# EAGLE design quadcopter (EAGLE 9.7.0)
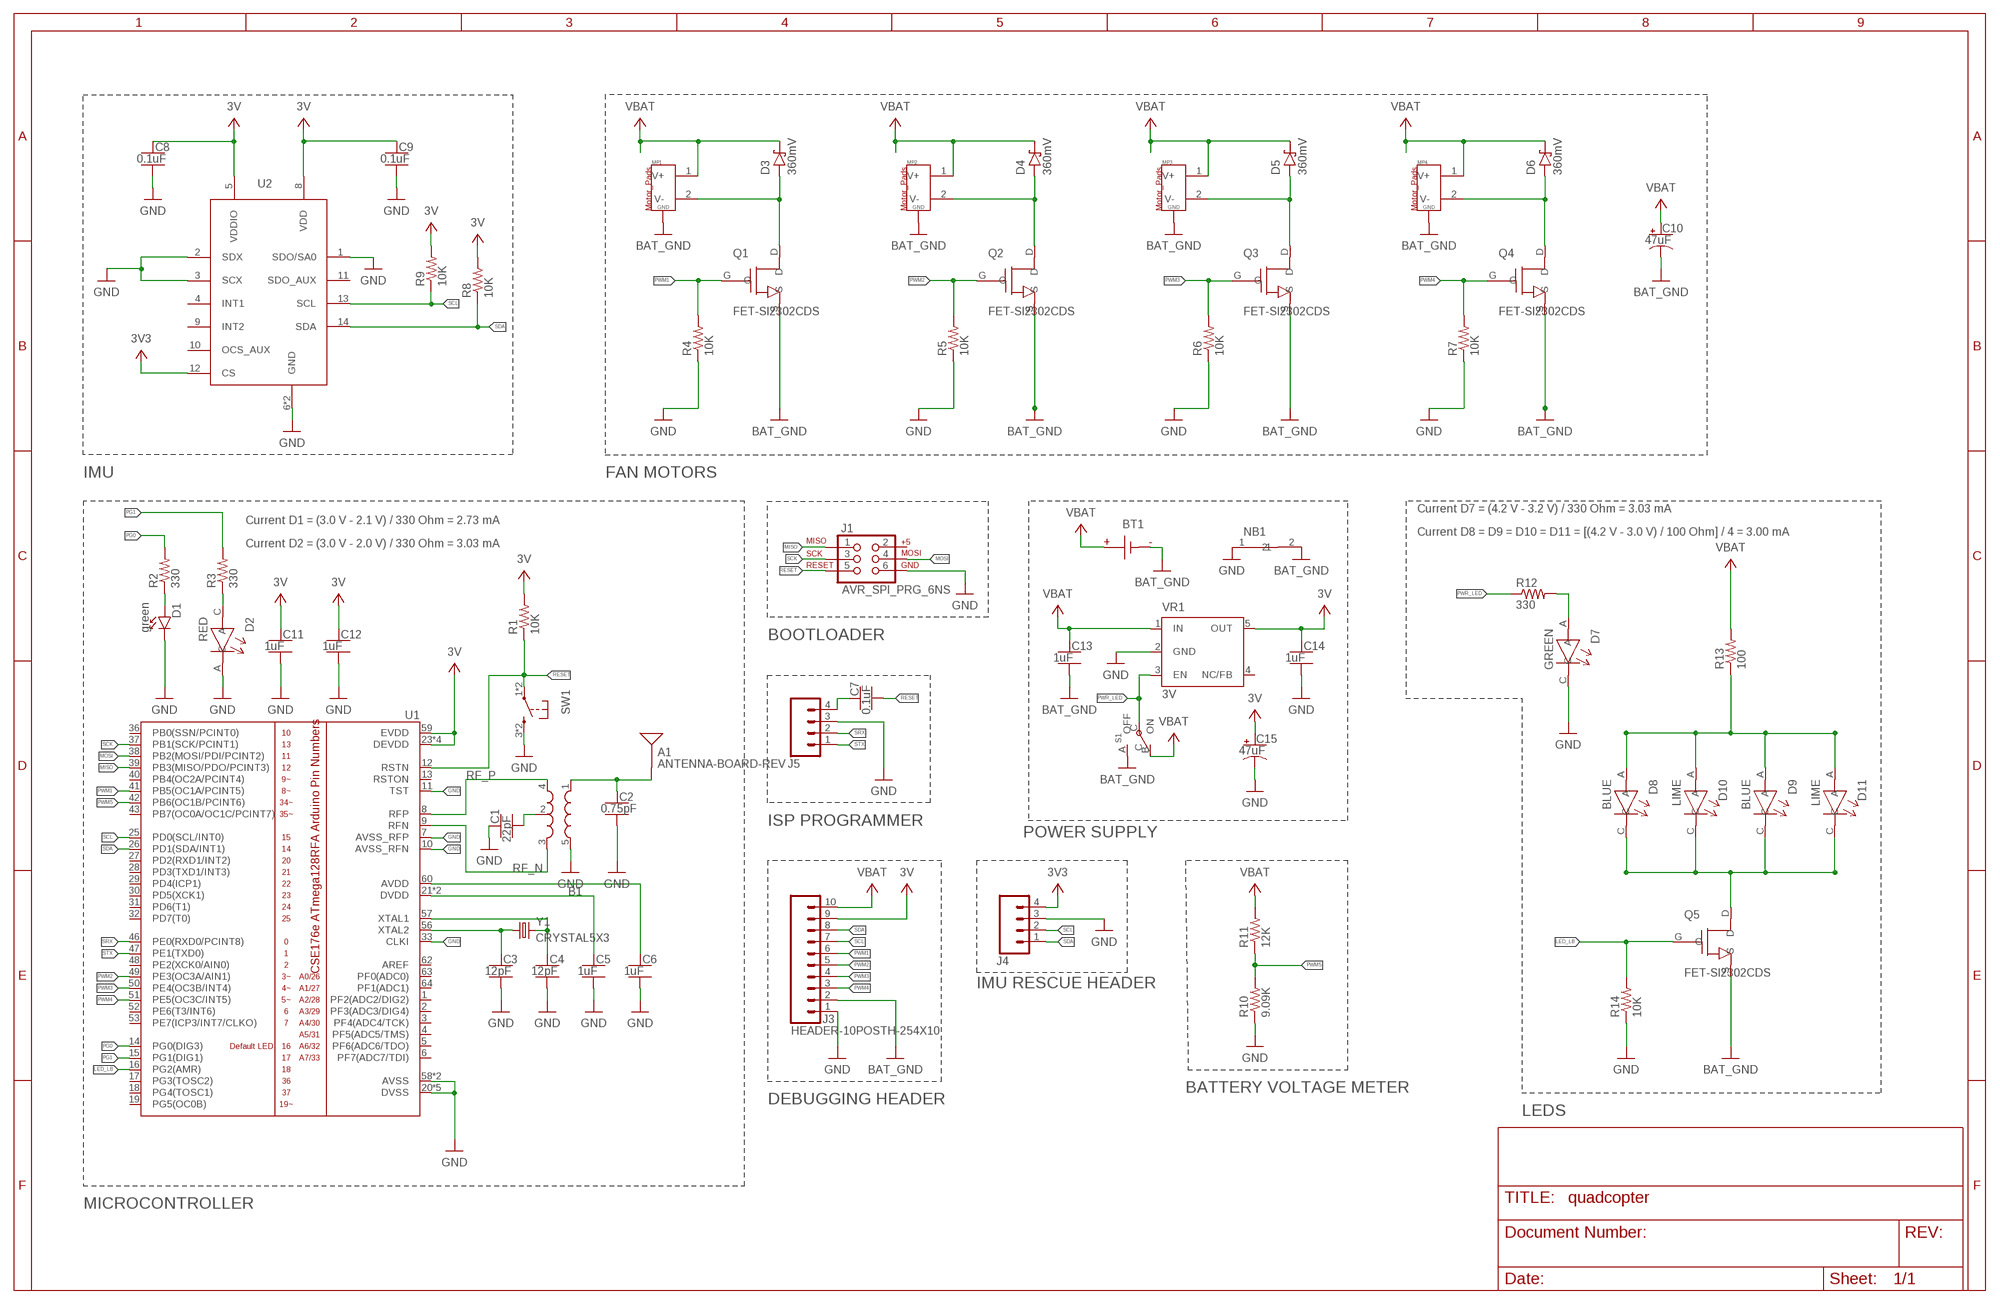
[diagram p0: schematic, sheet 1]
FRAME1 (FRAME_B_L): CREATOR: Unknown; DIST: Unknown; DISTPN: Unknown

## Parts
A1  ANTENNA-BOARD-REV  [ANT_PCB_2.4GHZ_NRF8001_1.6MM_1OZ_REV]
B1  BALUN0805  [BALUN]
BT1  BATTERY-SCREW-TERMINAL  [SCREW-TERMINAL-1X2-2.54MM]
C1  22pF  CAPACITOR-NP_SMD-2012-0805_CERAMIC-22PF  [CAPC2012X140_HS]
C2  0.75pF  CAPACITOR-NP_SMD-2012-0805_CERAMIC-0.75PF  [CAPC2012X140_HS]
C3  12pF  CAPACITOR-NP_SMD-2012-0805_CERAMIC-12PF  [CAPC2012X140_HS]
C4  12pF  CAPACITOR-NP_SMD-2012-0805_CERAMIC-12PF  [CAPC2012X140_HS]
C5  1uF  CAPACITOR-NP_SMD-2012-0805_CERAMIC-1UF  [CAPC2012X140_HS]
C6  1uF  CAPACITOR-NP_SMD-2012-0805_CERAMIC-1UF  [CAPC2012X140_HS]
C7  0.1uF  CAPACITOR-NP_SMD-2012-0805_CERAMIC-0.1UF  [CAPC2012X140_HS]
C8  0.1uF  CAPACITOR-NP_SMD-2012-0805_CERAMIC-0.1UF  [CAPC2012X140_HS]
C9  0.1uF  CAPACITOR-NP_SMD-2012-0805_CERAMIC-0.1UF  [CAPC2012X140_HS]
C10  47uF  CAPACITOR-POL_47UF-SMD-1206-TAJA  [CAPMP3216X180]
C11  1uF  CAPACITOR-NP_SMD-2012-0805_CERAMIC-1UF  [CAPC2012X140_HS]
C12  1uF  CAPACITOR-NP_SMD-2012-0805_CERAMIC-1UF  [CAPC2012X140_HS]
C13  1uF  CAPACITOR-NP_SMD-2012-0805_CERAMIC-1UF  [CAPC2012X140_HS]
C14  1uF  CAPACITOR-NP_SMD-2012-0805_CERAMIC-1UF  [CAPC2012X140_HS]
C15  47uF  CAPACITOR-POL_47UF-SMD-1206-TAJA  [CAPMP3216X180]
D1  green  DIODE-LED_SMD-2012-0805-GREEN  [LEDSC125X200X120-2_HS]
D2  RED  LED-RED  [0805_LED]
D3  360mV  DIODE-SCHOTTKY_-SMD-SOD123  [SODFL3516X96]
D4  360mV  DIODE-SCHOTTKY_-SMD-SOD123  [SODFL3516X96]
D5  360mV  DIODE-SCHOTTKY_-SMD-SOD123  [SODFL3516X96]
D6  360mV  DIODE-SCHOTTKY_-SMD-SOD123  [SODFL3516X96]
D7  GREEN  0805_LED-GREEN  [0805_LED]
D8  BLUE  1411_LED-BLUE  [1411_LED]
D9  BLUE  1411_LED-BLUE  [1411_LED]
D10  LIME  1411_LED-LIME  [1411_LED]
D11  LIME  1411_LED-LIME  [1411_LED]
J1  AVR_SPI_PRG_6NS  [2X3-NS]
J3  HEADER-10POSTH-254X10  [HDRV10W63P254_10X1_2540X254H838_HS]
J4  HEADER-4POS-0.1IN-FEMALE  [HDRVR4W80P254_1X4_1066X254X850B]
J5  HEADER-4POS-0.1IN-FEMALE-SMD-BOTTOM-ENTRY  [HEADER-1X4-BOTTOM-ENTRY]
MP1  MOTOR_PADS_GND-MOLEX-SMD  [MOLEX-0532610271]
MP2  MOTOR_PADS_GND-MOLEX-SMD  [MOLEX-0532610271]
MP3  MOTOR_PADS_GND-MOLEX-SMD  [MOLEX-0532610271]
MP4  MOTOR_PADS_GND-MOLEX-SMD  [MOLEX-0532610271]
NB1  NET-BRIDGE  [NET-BRIDGE]
Q1  FET-SI2302CDS  [SI2302MOSFET]
Q2  FET-SI2302CDS  [SI2302MOSFET]
Q3  FET-SI2302CDS  [SI2302MOSFET]
Q4  FET-SI2302CDS  [SI2302MOSFET]
Q5  FET-SI2302CDS  [SI2302MOSFET]
R1  10K  RESISTOR_SMD-2012-0805-10K  [RESC2012X60_HS]
R2  330  RESISTOR_SMD-2012-0805-330  [RESC2012X60_HS]
R3  330  RESISTOR_SMD-2012-0805-330  [RESC2012X60_HS]
R4  10K  RESISTOR_SMD-2012-0805-10K  [RESC2012X60_HS]
R5  10K  RESISTOR_SMD-2012-0805-10K  [RESC2012X60_HS]
R6  10K  RESISTOR_SMD-2012-0805-10K  [RESC2012X60_HS]
R7  10K  RESISTOR_SMD-2012-0805-10K  [RESC2012X60_HS]
R8  10K  RESISTOR_SMD-2012-0805-10K  [RESC2012X60_HS]
R9  10K  RESISTOR_SMD-2012-0805-10K  [RESC2012X60_HS]
R10  9.09K  RESISTOR_SMD-2012-0805-9.09K  [RESC2012X60_HS]
R11  12K  RESISTOR_SMD-2012-0805-12K  [RESC2012X60_HS]
R12  330  RESISTOR_SMD-2012-0805-330  [RESC2012X60_HS]
R13  100  RESISTOR_SMD-2012-0805-100  [RESC2012X60_HS]
R14  10K  RESISTOR_SMD-2012-0805-10K  [RESC2012X60_HS]
S1  POWER-SWITCH-MFS201N-9-Z-SMD-EDGE  [JS102011SAQN]
SW1  PUSHBUTTON_SMD-VERTICAL-1  [TE_FSM8JSMA_HS]
U1  ATMEGA128RFA1  [QFN-64]
U2  IMU_LSM6DSOX-LSM6DSOXTR  [LSM6DS0XTR]
VR1  3V  TPS73633-DBVT3V  [SOT23-DBV]
Y1  CRYSTAL5X3  [CRYSTAL-SMD-5X3]

## Nets
3V3 [PWR]: C8.1 C9.1 C11.1 C12.1 C14.1 C15.1(+) J3.9 J4.4 R1.2 R8.2 R9.2 U1.23(DEVDD) U1.34(DEVDD) U1.44(DEVDD) U1.54(DEVDD) U1.59(EVDD) U2.5(VDDIO) U2.8(VDD) U2.12(CS) VR1.5(OUT) ; supply symbol labelled 3V
BAT_GND [HIGHCURRENT]: BT1.1(N) C10.2(-) C13.2 J3.2 MP1.G1(GND) MP1.G2(GND) MP2.G1(GND) MP2.G2(GND) MP3.G1(GND) MP3.G2(GND) MP4.G1(GND) MP4.G2(GND) NB1.2 Q1.S Q2.S Q3.S Q4.S Q5.S S1.A(OFF)
GND [PWR]: B1.5(GND) C1.1 C2.2 C3.2 C4.2 C5.2 C6.2 C8.2 C9.2 C11.2 C12.2 C14.2 C15.2(-) D1.C D2.A(C) D7.C J1.6 J3.1 J4.3 J5.3 NB1.1 R4.1 R5.1 R6.1 R7.1 R10.1 R14.1 SW1.3 SW1.4 U1.7(AVSS_RFP) U1.10(AVSS_RFN) U1.11(TST) U1.20(DVSS) U1.24(DVSS) U1.33(CLKI) U1.35(DVSS) U1.45(DVSS) U1.55(DVSS) U1.58(AVSS) U1.61(AVSS) U2.1(SDO/SA0) U2.2(SDX) U2.3(SCX) U2.6(GND) U2.7(GND) VR1.2(GND)
LED_LB: Q5.G R14.2 U1.16(PG2(AMR))
MISO: J1.1 U1.39(PB3(MISO/PDO/PCINT3))
MOSI: J1.4 U1.38(PB2(MOSI/PDI/PCINT2))
N$1: B1.2(GND) C1.2
N$4 [RFSIG]: A1.FEED(SIGNAL) B1.1(IN) C2.1
N$6 [HIGHCURRENT]: D3.2(A) MP1.2(V-) Q1.D
N$8: D1.A R2.1
N$9: C3.1 U1.56(XTAL2) Y1.1
N$10: C4.1 U1.57(XTAL1) Y1.3
N$11: C5.1 U1.21(DVDD) U1.22(DVDD)
N$12: C6.1 U1.60(AVDD)
N$13 [HIGHCURRENT]: D4.2(A) MP2.2(V-) Q2.D
N$14 [HIGHCURRENT]: D5.2(A) MP3.2(V-) Q3.D
N$15 [HIGHCURRENT]: D6.2(A) MP4.2(V-) Q4.D
N$16: C7.1 J5.4
N$17: D2.C(A) R3.1
N$20: D7.A R12.2
N$21: D8.A D9.A D10.A D11.A R13.1
N$22: D8.C D9.C D10.C D11.C Q5.D
PG0: R2.2 U1.14(PG0(DIG3))
PG1: R3.2 U1.15(PG1(DIG1))
PWM1: J3.6 Q1.G R4.2 U1.41(PB5(OC1A/PCINT5))
PWM2: J3.5 Q2.G R5.2 U1.49(PE3(OC3A/AIN1))
PWM3: J3.4 Q3.G R6.2 U1.50(PE4(OC3B/INT4))
PWM4: J3.3 Q4.G R7.2 U1.51(PE5(OC3C/INT5))
PWM5: R10.2 R11.1 U1.42(PB6(OC1B/PCINT6))
PWR_LED: R12.1 S1.C VR1.3(EN)
RESET: C7.2 J1.5 R1.1 SW1.1 SW1.2 U1.12(RSTN)
RF_N: B1.3(OUT2) U1.9(RFN)
RF_P: B1.4(OUT1) U1.8(RFP)
SCK: J1.3 U1.37(PB1(SCK/PCINT1))
SCL: J3.7 J4.2 R9.1 U1.25(PD0(SCL/INT0)) U2.13(SCL)
SDA: J3.8 J4.1 R8.1 U1.26(PD1(SDA/INT1)) U2.14(SDA)
SRX: J5.2 U1.46(PE0(RXD0/PCINT8))
STX: J5.1 U1.47(PE1(TXD0))
VBAT [HIGHCURRENT]: BT1.2(P) C10.1(+) C13.1 D3.1(C) D4.1(C) D5.1(C) D6.1(C) J3.10 MP1.1(V+) MP2.1(V+) MP3.1(V+) MP4.1(V+) R11.2 R13.2 S1.B(ON) VR1.1(IN)
Unconnected: J1.2 U1.1(PF2(ADC2/DIG2)) U1.2(PF3(ADC3/DIG4)) U1.3(PF4(ADC4/TCK)) U1.4(PF5(ADC5/TMS)) U1.5(PF6(ADC6/TDO)) U1.6(PF7(ADC7/TDI)) U1.13(RSTON) U1.17(PG3(TOSC2)) U1.18(PG4(TOSC1)) U1.19(PG5(OC0B)) U1.27(PD2(RXD1/INT2)) U1.28(PD3(TXD1/INT3)) U1.29(PD4(ICP1)) U1.30(PD5(XCK1)) U1.31(PD6(T1)) U1.32(PD7(T0)) U1.36(PB0(SSN/PCINT0)) U1.40(PB4(OC2A/PCINT4)) U1.43(PB7(OC0A/OC1C/PCINT7)) U1.48(PE2(XCK0/AIN0)) U1.52(PE6(T3/INT6)) U1.53(PE7(ICP3/INT7/CLKO)) U1.62(AREF) U1.63(PF0(ADC0)) U1.64(PF1(ADC1)) U2.4(INT1) U2.9(INT2) U2.10(OCS_AUX) U2.11(SDO_AUX) VR1.4(NC/FB)

## Notes on the sheet
- IMU | FAN MOTORS
- Current D7 = (4.2 V - 3.2 V) / 330 Ohm = 3.03 mA
- Current D1 = (3.0 V - 2.1 V) / 330 Ohm = 2.73 mA
- Current D8 = D9 = D10 = D11 = [(4.2 V - 3.0 V) / 100 Ohm] / 4 = 3.00 mA
- Current D2 = (3.0 V - 2.0 V) / 330 Ohm = 3.03 mA
- BOOTLOADER
- ISP PROGRAMMER
- POWER SUPPLY
- IMU RESCUE HEADER
- BATTERY VOLTAGE METER
- DEBUGGING HEADER
- LEDS
- MICROCONTROLLER

## Library data of the parts
A1 = quadparts_prebuilt_2022:ANTENNA: Single endded antenna.; CREATOR: Swanson; DESC: trace antenna; DIST: NA; DISTPN: NA; MFR: NA; MOUNTING: NONE; MPN: NA; POPULATE: NO
B1 = quadparts_prebuilt_2022:BALUN: A balun to convert differential radio-frequency outputs from the microcontroller into a single-ended driver for the antenna.; CREATOR: Swanson; DATASHEET: http://katalog.we-online.de/pbs/datasheet/748421245.pdf; DESC: BALUN 2.4GHZ-2.5GHZ 50/100 0805; DIST: Digikey; DISTPN: 732-2230-1-ND; MFR: Wurth Electronics Inc.; MOUNTING: SMD; MPN: 748421245; PACKAGE: 0805; PRICE: 2.63; REVIEWER: Swanson
BT1 = quadparts_prebuilt:BATTERY: Connections for a battery.; CREATOR: Swanson; DIST: DIGIKEY; DISTPN: ED10561-ND; MOUNTING: TH; PIN1: -; PIN2: +
C1 = quadparts_prebuilt:CAPACITOR-NP_: Nonpolarized capacitor; CREATOR: Swanson; DESC: CAP CER 22PF 250V C0G/NP0 0805; DIST: Digikey; DISTPN: 490-5534-1-ND; MFR: Murata Electronics; MOUNTING: SMD; MPN: GRM21A5C2E220JW01D; PACKAGE: 0805; REVIEWER: Swanson
C2 = quadparts_prebuilt:CAPACITOR-NP_: Nonpolarized capacitor; CREATOR: Swanson; DESC: CAP CER 0.75PF 100V C0G/NP0 0805; DIST: Digikey; DISTPN: 490-3585-1-ND; MFR: Murata Electronics; MOUNTING: SMD; MPN: GQM2195C2AR75CB01D; PACKAGE: 0805; REVIEWER: Swanson
C3 C4 = quadparts_prebuilt:CAPACITOR-NP_: Nonpolarized capacitor; CREATOR: Swanson; DESC: CAP CER 12PF 250V C0G/NP0 0805; DIST: Digikey; DISTPN: 490-5531-1-ND; MFR: Murata Electronics; MOUNTING: SMD; MPN: GRM21A5C2E120JW01D; PACKAGE: 0805; REVIEWER: Swanson
C5 C6 C11-C14 = quadparts_prebuilt:CAPACITOR-NP_: Nonpolarized capacitor; CREATOR: Swanson; DIST: Digikey; DISTPN: 587-1281-1-ND; MFR: Taiyo Yuden; MOUNTING: SMD; MPN: TMK212B7105KG-T; REVIEWER: Swanson
C7-C9 = quadparts_prebuilt:CAPACITOR-NP_: Nonpolarized capacitor; CREATOR: Swanson; DESC: CAP CER 0.1UF 100V X7R 0805; DIST: Digikey; DISTPN: 445-1418-1-ND; MFR: TDK Corporation; MOUNTING: SMD; MPN: C2012X7R2A104K125AA; PACKAGE: 0805; REVIEWER: Swanson
C10 C15 = quadparts_prebuilt:CAPACITOR-POL_: Polarized capacitor; CREATOR: Swanson; DESC: CAP TANT 47UF 10% 6.3V 1206; DIST: DIGIKEY; DISTPN: 478-11462-1-ND; MFR: AVX Corporation; MOUNTING: SMD; MPN: TAJA476K006SNJV; PACKAGE: 1206
D1 = quadparts_prebuilt:DIODE-LED_: Light emitting diode; CREATOR: Swanson; DIST: Digikey; DISTPN: 160-1179-1-ND; MFR: Lite-On Inc; MOUNTING: SMD; MPN: LTST-C170GKT; REVIEWER: Swanson
D2 = custom:LED; CREATOR: CHRISTOPHER VU; DIST: Digikey; DISTPN: 160-1178-1-ND
D3-D6 = quadparts_prebuilt:DIODE-SCHOTTKY_: Schottky diode; CREATOR: Swanson; DESC: DIODE SCHOTTKY 30V 1.5A SFLAT; DIST: Digikey; DISTPN: CRS08QMCT-ND; MFR: Toshiba Semiconductor and Storage; MOUNTING: SMD; MPN: CRS08(TE85L,Q,M); REVIEWER: Swanson
D7 = LED:0805_LED; CREATOR: CHRISTOPHER VU; DIST: Digikey; DISTPN: 732-4983-1-ND
D8 D9 = LED:1411_LED; CREATOR: CHRISTOPHER VU; DIST: Digikey; DISTPN: 1416-2058-1-ND
D10 D11 = LED:1411_LED; CREATOR: CHRISTOPHER VU; DIST: Digikey; DISTPN: 1416-2057-1-ND
J1 = quadparts_prebuilt_2022:AVR_SPI_PRG_6: AVR ISP 6 Pin This is the in-system programming (ISP) connector for Atmel Microcontrollers programming.; CREATOR: Swanson; DATASHEET: http://portal.fciconnect.com/Comergent//fci/drawing/67996.pdf; DIST: Digikey; DISTPN: 609-3234-ND; MFR: Amphenol FCI; MOUNTING: TH; MPN: 67997-206HLF; PRICE: 0.31; REVIEWER: Swanson
J3 = quadparts_prebuilt:HEADER-10POS: 10 pin single inline pin header, socket, or connector; CREATOR: Swanson; DATASHEET: http://portal.fciconnect.com/Comergent//fci/drawing/68000.pdf; DIST: Digikey; DISTPN: 609-3250-ND; MFR: Amphenol FCI; MOUNTING: TH; MPN: 68000-110HLF; PRICE: 0.55; REVIEWER: Swanson
J4 = quadparts_prebuilt:HEADER-4POS; CREATOR: Swanson; DIST: Digikey; DISTPN: S7002-ND
J5 = quadparts_prebuilt:HEADER-4POS; CREATOR: Swanson; DESC: CONN RCPT 4POS 0.1 GOLD SMD; DIST: DIGIKEY; DISTPN: A121787CT-ND; MFR: TE Connectivity AMP Connectors; MOUNTING: SMD; MPN: 1241152-4
MP1-MP4 = quadparts_prebuilt:MOTOR_PADS_GND: Connections a brushed motor.; CREATOR: Swanson; DESC: CONN HEADER SMD R/A 2POS 1.25MM; DIST: DIGIKEY; DISTPN: WM7620CT-ND; MFR: Molex; MOUNTING: SMD; MPN: 532610271
NB1 = custom_:NET-BRIDGE; CREATOR: DARRYL TAYAG; DIST: N/A; DISTPN: N/A
Q1-Q5 = custom:FET; CREATOR: CHRISTOPHER VU; DIST: Digikey; DISTPN: SI2302CDS-T1-E3CT-ND
R1 R4-R9 R14 = quadparts_prebuilt:RESISTOR_: Resistor; CREATOR: Swanson; DESC: RES SMD 10K OHM 5% 1/8W 0805; DIST: Digikey; DISTPN: 311-10KARCT-ND; MFR: Yageo; MOUNTING: SMD; MPN: RC0805JR-0710KL; PACKAGE: 0805; REVIEWER: Swanson
R2 R3 R12 = quadparts_prebuilt:RESISTOR_: Resistor; CREATOR: Swanson; DIST: Digikey; DISTPN: 311-330ARCT-ND; MFR: Yageo; MOUNTING: SMD; MPN: RC0805JR-07330RL; REVIEWER: Swanson
R10 = quadparts_prebuilt:RESISTOR_: Resistor; CREATOR: Swanson; DIST: DIGIKEY; DISTPN: YAG5383CT-ND; MOUNTING: SMD
R11 = quadparts_prebuilt:RESISTOR_: Resistor; CREATOR: Swanson; DIST: DIGIKEY; DISTPN: YAG3692CT-ND; MOUNTING: SMD
R13 = quadparts_prebuilt:RESISTOR_: Resistor; CREATOR: Swanson; DIST: Digikey; DISTPN: 311-100ARCT-ND; MFR: Yageo; MOUNTING: SMD; MPN: RC0805JR-07100RL; REVIEWER: Swanson
S1 = quadparts_prebuilt:POWER-SWITCH-MFS201N-9-Z; CREATOR: Swanson; DESC: SWITCH SLIDE SPDT 300MA 6V; DIST: DIGIKEY; DISTPN: 401-1999-1-ND; MFR: C&K; MOUNTING: SMD; MPN: JS102011SAQN
SW1 = quadparts_prebuilt_2022:PUSHBUTTON_: "Tactile" or "clicky" button.; CREATOR: Swanson; DIST: Digikey; DISTPN: 450-1129-ND; MFR: TE Connectivity Alcoswitch Switches; MOUNTING: SMD; MPN: FSM4JSMA; REVIEWER: Swanson
U1 = quadparts_prebuilt_2022:ATMEGA128RFA1: ATmega128RFA1 8-bit AVR Microcontroller with Low Power 2.4GHz Transceiver for ZigBee and IEEE 802.15.4; CREATOR: Swanson; DATASHEET: http://www.atmel.com/Images/Atmel-8266-MCU_Wireless-ATmega128RFA1_Datasheet.pdf; DESC: IC RF TXRX+MCU 802.15.4 64VFQFN; DIST: Digikey; DISTPN: ATMEGA128RFA1-ZU-ND; MFR: Microchip Technology; MOUNTING: SMD; MPN: ATMEGA128RFA1-ZU; PACKAGE: QFN; PRICE: 10.21; REVIEWER: Swanson
U2 = custom:IMU_LSM6DSOX; CREATOR: CHRISTOPHER VU; DIST: Digikey; DISTPN: 497-18367-1-ND
VR1 = quadparts_prebuilt:TPS73633-DBVT: LP3985-series voltage regulators.; CREATOR: Swanson; DATASHEET: http://www.ti.com/lit/ds/symlink/lp3985.pdf; DIST: Digikey; DISTPN: LP3985IM5X-3.0/NOPBCT-ND; MFR: Texas Instruments; MOUNTING: SMD; MPN: LP3985IM5X-3.0/NOPB; PRICE: 0.59; REVIEWER: Swanson
Y1 = quadparts_prebuilt_2022:CRYSTAL: Crystals to provide clock references for microcontrollers, etc.; CREATOR: Swanson; DATASHEET: http://www.abracon.com/Resonators/abm3b.pdf; DESC: CRYSTAL 16.0000MHZ 18PF SMD; DIST: Digikey; DISTPN: 535-9122-1-ND; MFR: Abracon LLC; MOUNTING: SMD; MPN: ABM3B-16.000MHZ-B2-T; PRICE: 0.68; PROD_ID: XTAL-08218; REVIEWER: Swanson

## Net classes
1 RFSIG: width 1.27 mm
2 PWR: width 0.254 mm, drill 0.35 mm
3 HIGHCURRENT: width 0.762 mm, drill 0.508 mm

## Board
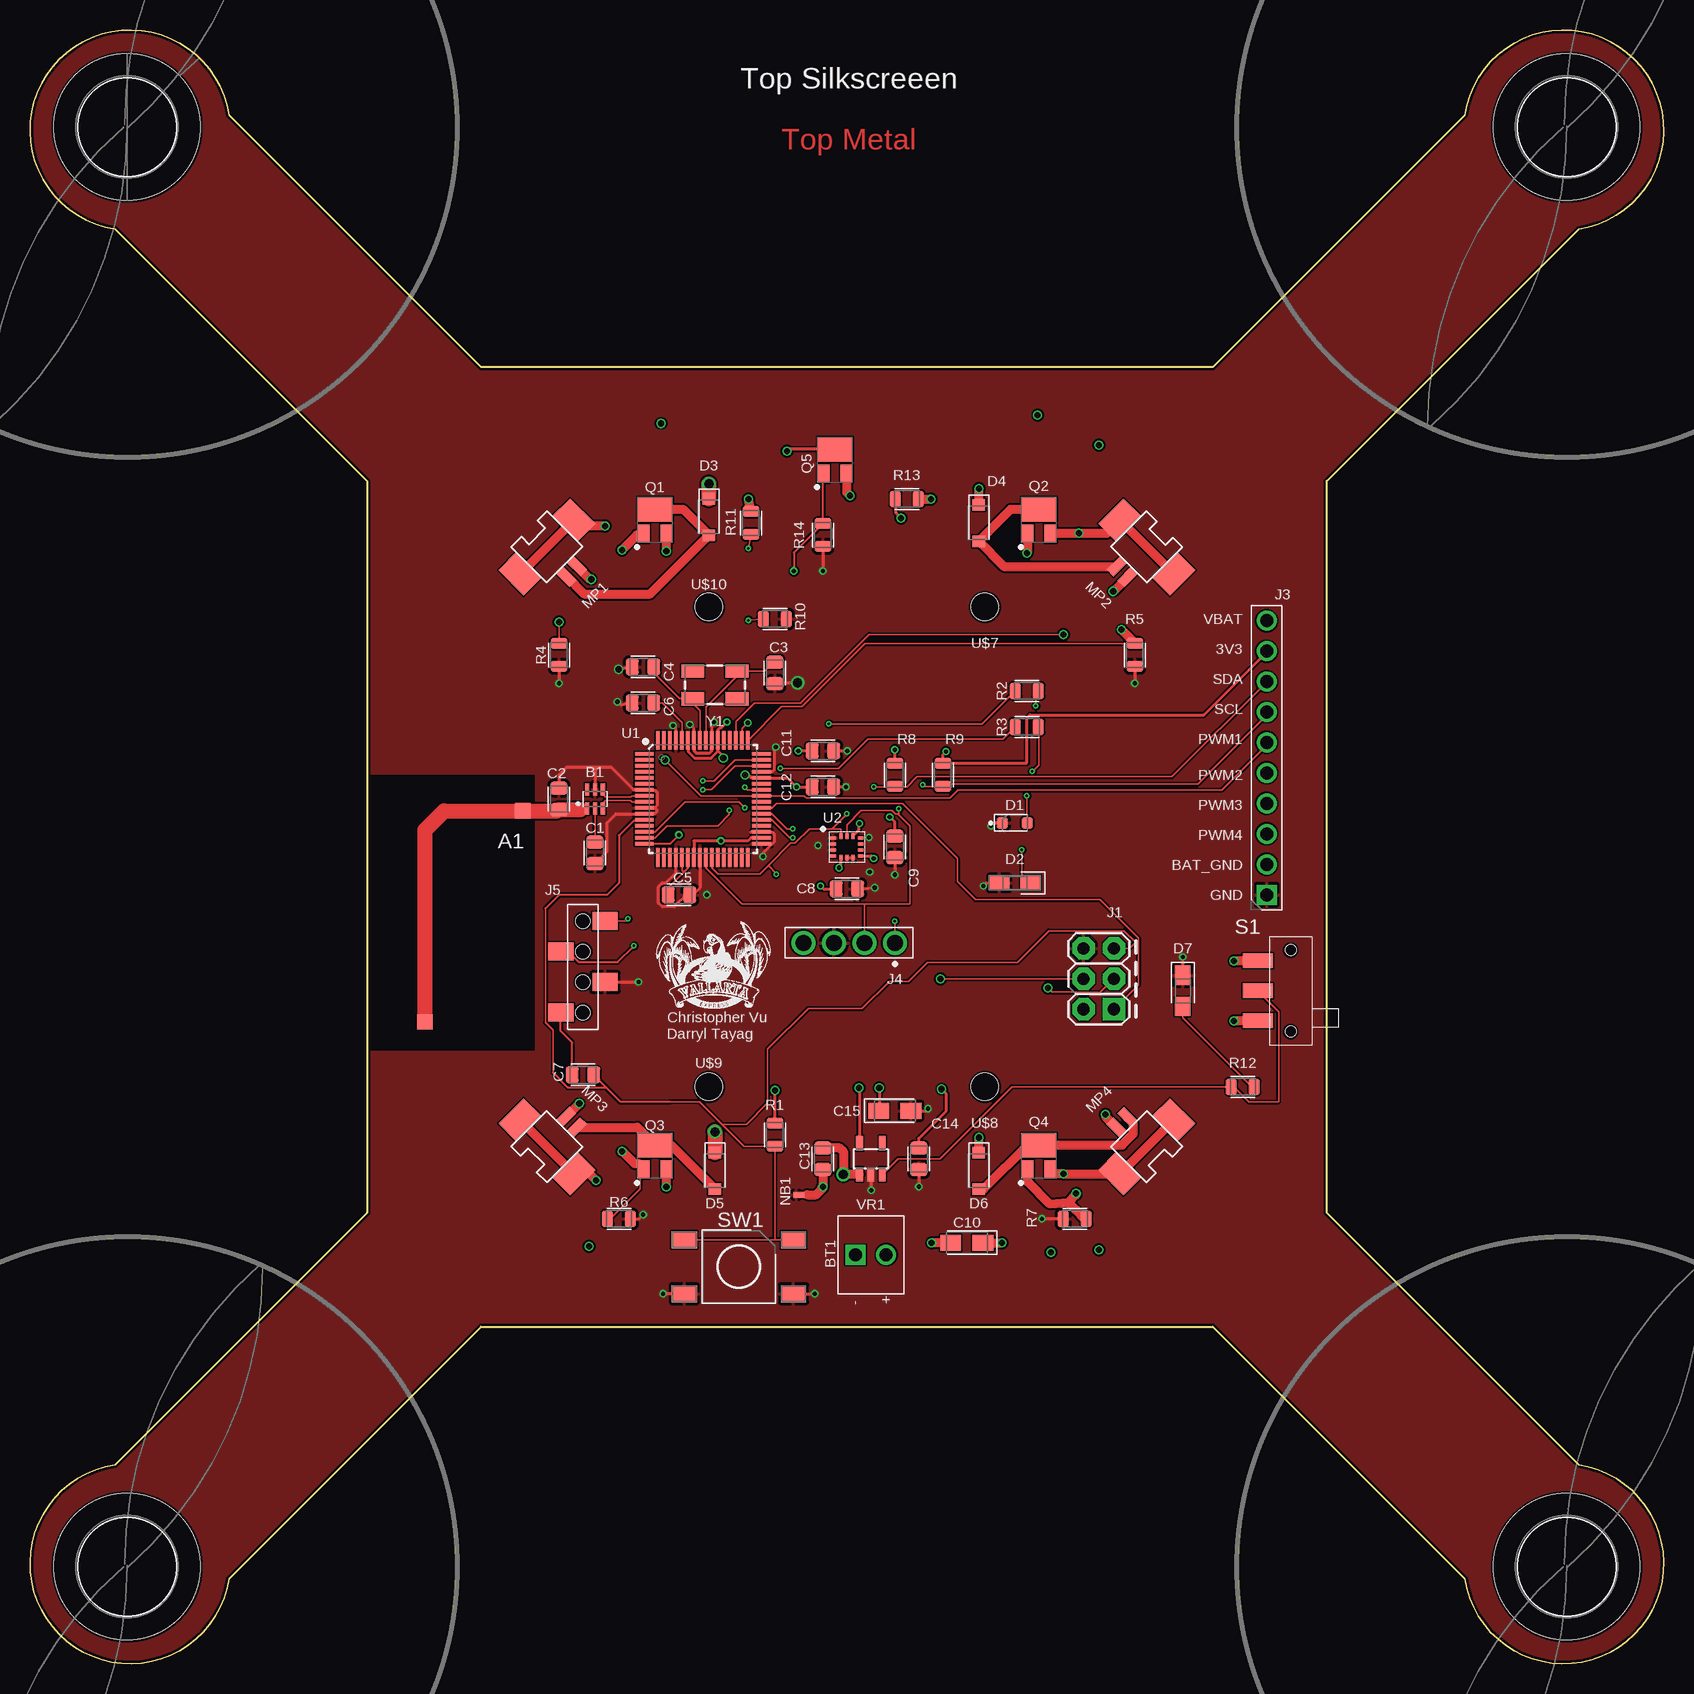
[diagram p1: board, top side]
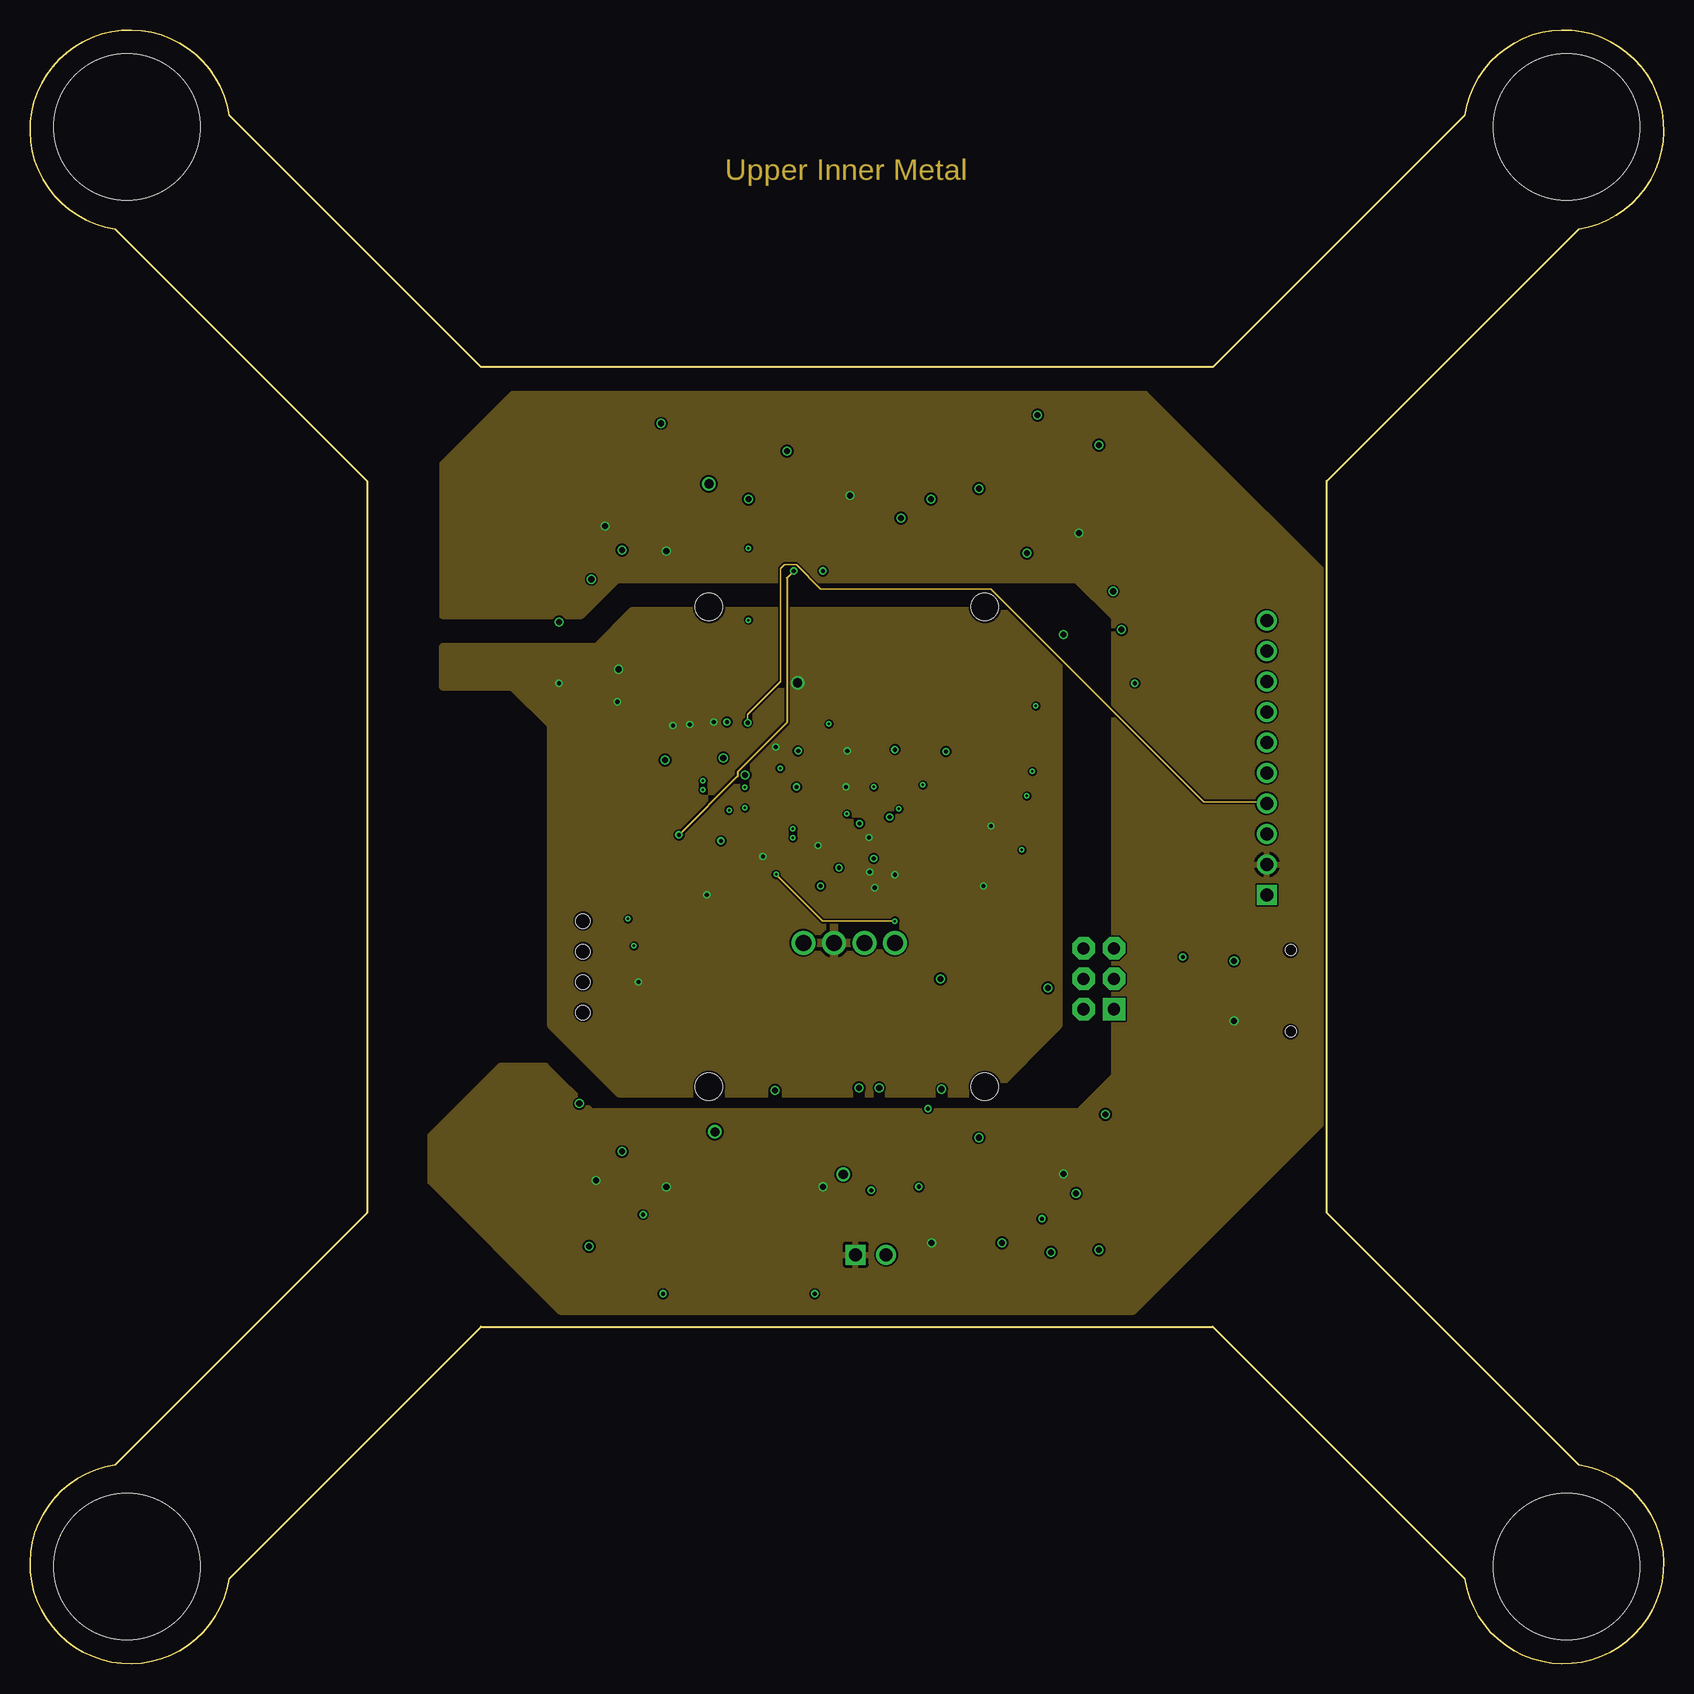
[diagram p2: board, inner layer Route2]
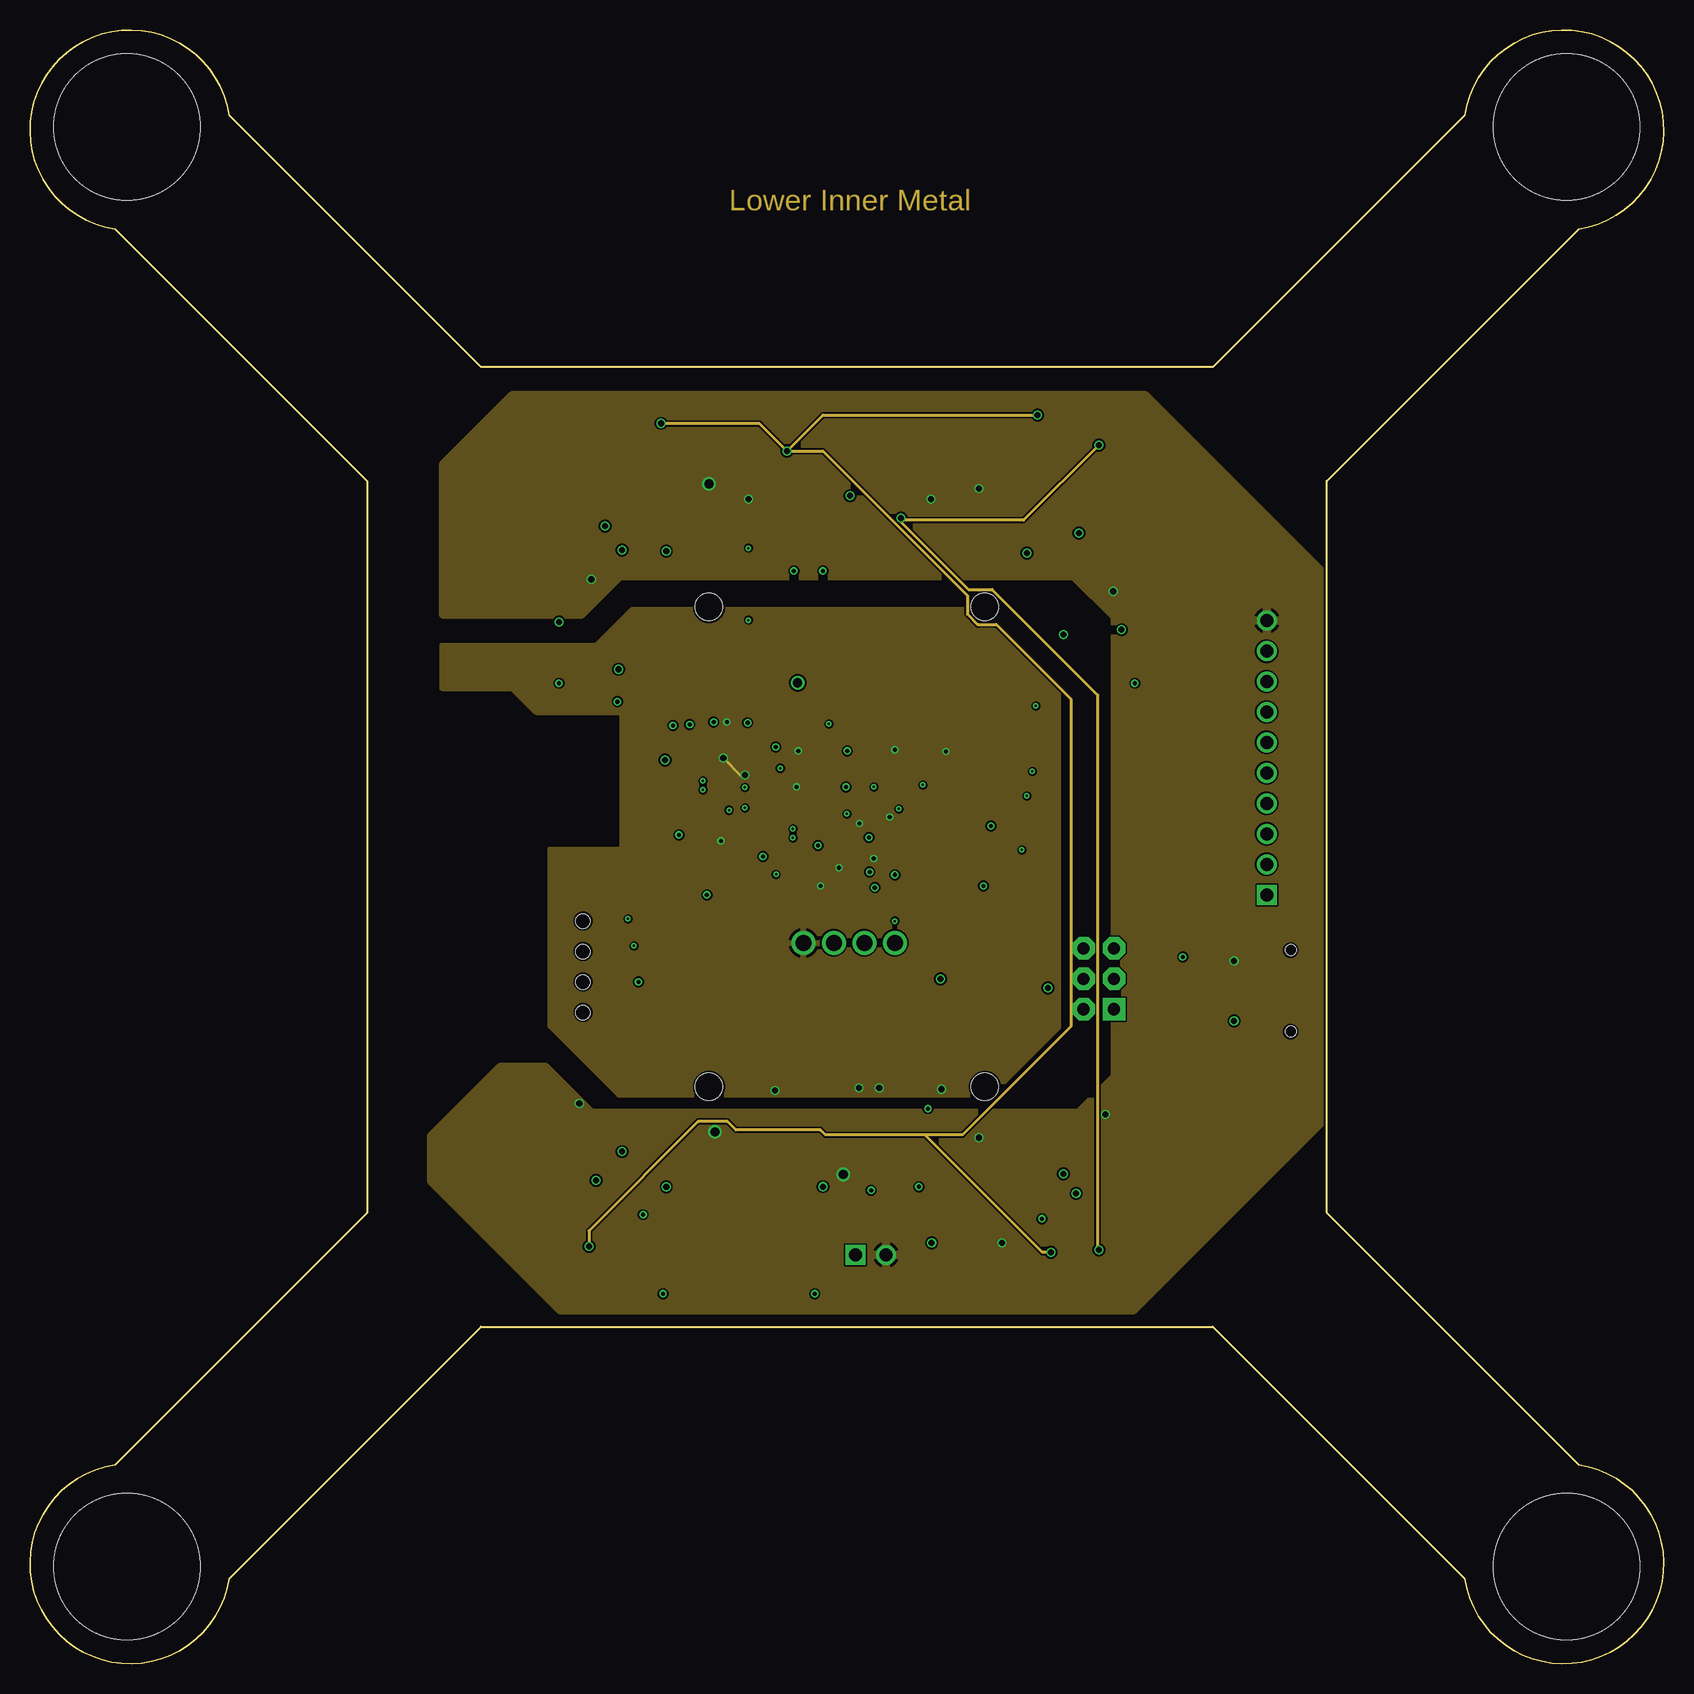
[diagram p3: board, inner layer Route15]
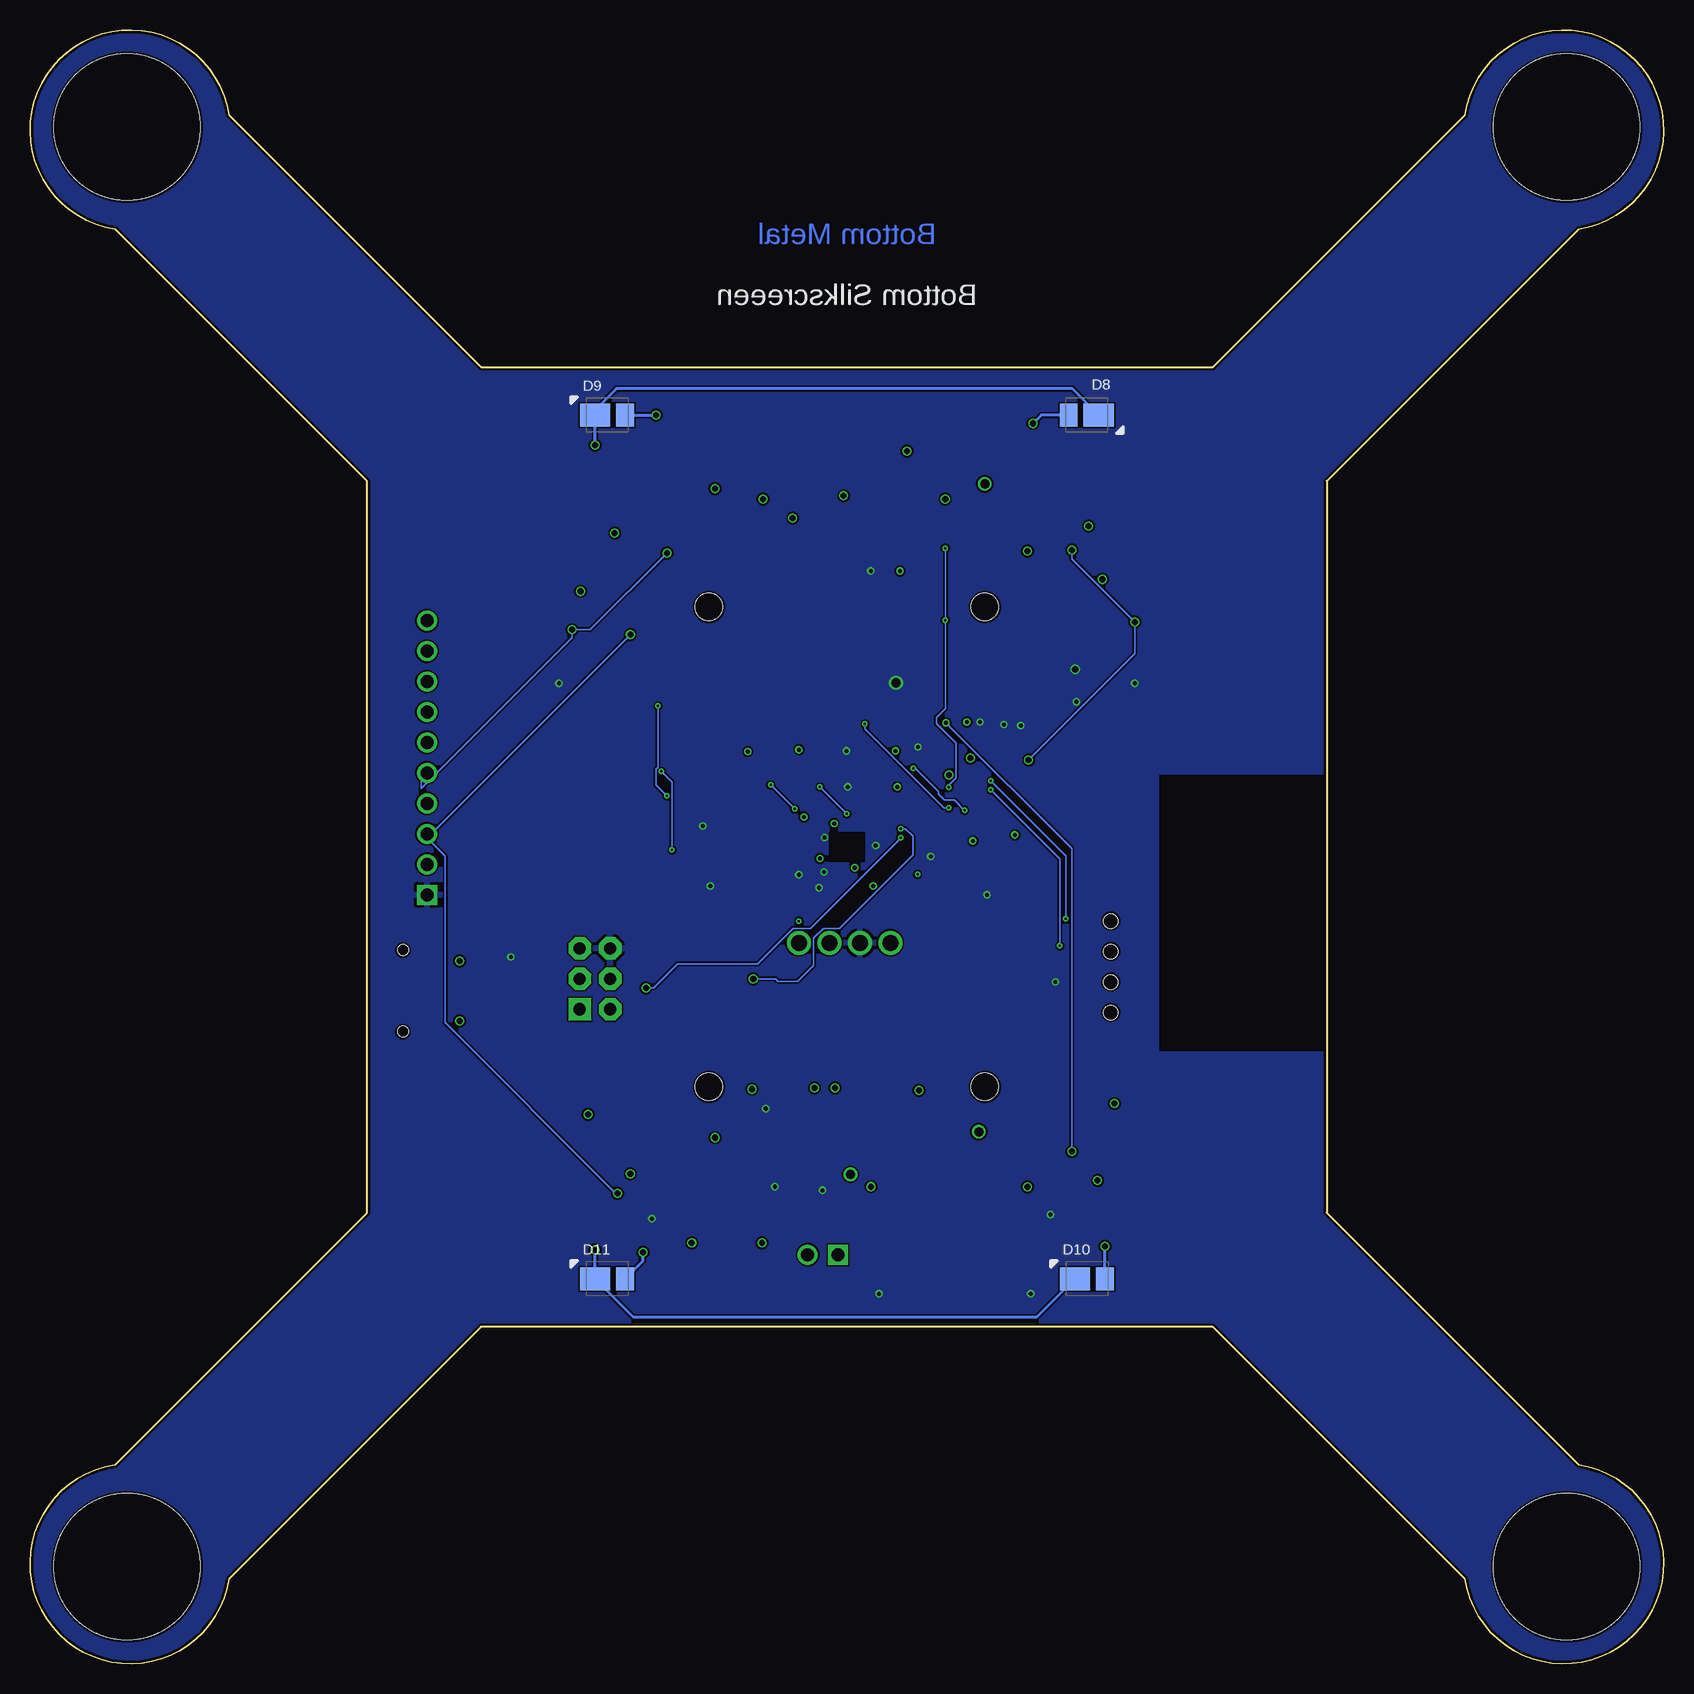
[diagram p4: board, bottom side, seen from below]

Size 136.19 x 136.19 mm. Coordinates in mm from the lower left corner, seen from the top.
Outline: 28.09,98.59 28.09,37.59 7.09,16.59 arc253 16.59,7.09 37.59,28.09 98.59,28.09 119.59,7.09 arc253 129.09,16.59 108.09,37.59 108.09,98.59 129.09,119.59 arc253 119.59,129.09 98.59,108.09 37.59,108.09 16.59,129.09 arc253 7.09,119.59 28.09,98.59
Copper layers (1*2*15*16): Top 0.035559375mm / dielectric 1.501140625mm / Route2 0.035559375mm / dielectric 0.149859375mm / Route15 0.035559375mm / dielectric 0.200659375mm / Bottom 0.035559375mm
Design rules "pcbcart-4layer-5mil-small-cream": minimum track width 5mil, minimum drill 8mil, track to track 6mil, track to pad 6mil, pad to pad 6mil, via to via 6mil, smd to smd 6mil, copper to edge 0.2mm, drill to drill 10mil, minimum pad ring 5mil, minimum via ring 5mil, stop-mask expansion 3mil, vias tented up to drill 0.45mm, thermal gap 10mil
Holes 12.2 mm at 8.09,128.09 8.09,8.09 128.09,8.09 128.09,128.09

### Footprints (pad centres in the part's own frame; a part is rotated, then mirrored left to right if it is on the bottom)
ANT_PCB_2.4GHZ_NRF8001_1.6MM_1OZ_REV = smd 1.27 x 1.27: FEED 0,0; TESTPOINT 8.169,17.605
BALUN = smd 0.35 x 1: 1 -0.65,-0.8; 2 0,-0.8; 3 0.65,-0.8; 4 0.65,0.8; 5 0,0.8; 6 -0.65,0.8
SCREW-TERMINAL-1X2-2.54MM = drill 1.1 square: 1 -1.27,0 | drill 1.1: 2 1.27,0
CAPC2012X140_HS = smd 1.08 x 1.42: 1 -0.895,0; 2 0.895,0
CAPMP3216X180 = smd 1.735 x 1.315: 1 -1.34,0; 2 1.34,0
LEDSC125X200X120-2_HS = smd 0.94 x 0.99: A -1.045,0; C 1.045,0
0805_LED = smd 1.7 x 1.2: A -1.3,0; C 1.3,0
SODFL3516X96 = smd 0.962 x 1.029: 1 -1.525,0; 2 1.525,0
0805_LED' = smd 1.6 x 1.3: A -1.3,0; C 1.3,0
1411_LED = smd 2.53 x 1.9: A -0.985,0 | smd 1.47 x 1.9: C 1.515,0
2X3-NS = drill 1.016 pad 1.88 square: 1 -2.54,-1.27 | drill 1.016 pad 1.88 octagon: 2 -2.54,1.27; 3 0,-1.27; 4 0,1.27; 5 2.54,-1.27; 6 2.54,1.27
HDRV10W63P254_10X1_2540X254H838_HS = drill 1.1 pad 1.65 square: 1 0,0 | drill 1.1 pad 1.65: 2 2.54,0; 3 5.08,0; 4 7.62,0; 5 10.16,0; 6 12.7,0; 7 15.24,0; 8 17.78,0; 9 20.32,0; 10 22.86,0
HDRVR4W80P254_1X4_1066X254X850B = drill 1.331 pad 1.997: 1 0,0; 2 2.54,0; 3 5.08,0; 4 7.62,0
HEADER-1X4-BOTTOM-ENTRY = smd 1.5 x 2.1: 1 3.81,-1.85; 2 1.27,1.85; 3 -1.27,-1.85; 4 -3.81,1.85 | hole 1.2: -1.27,0; -3.81,0; 1.27,0; 3.81,0
MOLEX-0532610271 = smd 0.8 x 1.6: 1 -0.637,2.9; 2 0.613,2.9 | smd 2.1 x 3: G1 -3.175,0; G2 3.175,0
NET-BRIDGE = smd 0.5 x 0.5: 1 -0.2,0; 2 0.2,0
SI2302MOSFET = smd 2.05 x 2.9: D 1.15,0 | smd 1.5 x 1: G -0.875,0.95; S -0.875,-0.95
RESC2012X60_HS = smd 0.92 x 1.38: 1 -0.955,0; 2 0.955,0
JS102011SAQN = smd 1.2 x 2.5: A -2.5,2.75; B 2.5,2.75; C 0,2.75 | hole 0.9: -3.4,0; 3.4,0
TE_FSM8JSMA_HS = smd 1.4 x 2.1: 1 -2.25,4.55; 2 -2.25,-4.55; 3 2.25,4.55; 4 2.25,-4.55
QFN-64 = smd 1.562 x 0.28: 1 -4.881,3.75; 2 -4.881,3.25; 3 -4.881,2.75; 4 -4.881,2.25; 5 -4.881,1.75; 6 -4.881,1.25; 7 -4.881,0.75; 8 -4.881,0.25; 9 -4.881,-0.25; 10 -4.881,-0.75; 11 -4.881,-1.25; 12 -4.881,-1.75; 13 -4.881,-2.25; 14 -4.881,-2.75; 15 -4.881,-3.25; 16 -4.881,-3.75; 33 4.881,-3.75; 34 4.881,-3.25; 35 4.881,-2.75; 36 4.881,-2.25; 37 4.881,-1.75; 38 4.881,-1.25; 39 4.881,-0.75; 40 4.881,-0.25; 41 4.881,0.25; 42 4.881,0.75; 43 4.881,1.25; 44 4.881,1.75; 45 4.881,2.25; 46 4.881,2.75; 47 4.881,3.25; 48 4.881,3.75 | smd 0.28 x 1.562: 17 -3.75,-4.881; 18 -3.25,-4.881; 19 -2.75,-4.881; 20 -2.25,-4.881; 21 -1.75,-4.881; 22 -1.25,-4.881; 23 -0.75,-4.881; 24 -0.25,-4.881; 25 0.25,-4.881; 26 0.75,-4.881; 27 1.25,-4.881; 28 1.75,-4.881; 29 2.25,-4.881; 30 2.75,-4.881; 31 3.25,-4.881; 32 3.75,-4.881; 49 3.75,4.881; 50 3.25,4.881; 51 2.75,4.881; 52 2.25,4.881; 53 1.75,4.881; 54 1.25,4.881; 55 0.75,4.881; 56 0.25,4.881; 57 -0.25,4.881; 58 -0.75,4.881; 59 -1.25,4.881; 60 -1.75,4.881; 61 -2.25,4.881; 62 -2.75,4.881; 63 -3.25,4.881; 64 -3.75,4.881
LSM6DS0XTR = smd 0.475 x 0.25: 1 -1.163,0.75; 2 -1.163,0.25; 3 -1.163,-0.25; 4 -1.163,-0.75; 8 1.163,-0.75; 9 1.163,-0.25; 10 1.163,0.25; 11 1.163,0.75 | smd 0.25 x 0.475: 5 -0.5,-0.912; 6 0,-0.912; 7 0.5,-0.912; 12 0.5,0.912; 13 0,0.912; 14 -0.5,0.912
2-56-MOUNTING-HOLE-NO-METAL = hole 2.261: 0,0
SOT23-DBV = smd 0.55 x 1.2: 1 -0.95,-1.3; 2 0,-1.3; 3 0.95,-1.3; 4 0.95,1.3; 5 -0.95,1.3
CRYSTAL-SMD-5X3 = smd 1.9 x 1.1: 1 -1.85,-1.15; 2 1.85,-1.15; 3 1.85,1.15; 4 -1.85,1.15

### Placement (x,y rotation side)
A1  41.09,71.09 180 top
B1  47.09,72.09 0 top
BT1  70.09,34.09 0 top
C1  47.09,67.59 90 top
C2  44.09,72.09 90 top
C3  62.09,82.59 270 top
C4  51.09,83.09 180 top
C5  54.09,64.09 0 top
C6  51.09,80.09 180 top
C7  46.09,49.09 0 top
C8  68.09,64.59 0 top
C9  72.09,68.09 270 top
C10  78.09,35.09 180 top
C11  66.09,76.09 0 top
C12  66.09,73.09 0 top
C13  66.09,42.09 270 top
C14  74.09,42.09 270 top
C15  72.09,46.09 0 top
D1  82.09,70.09 180 top
D2  82.09,65.09 0 top
D3  56.59,95.59 270 top
D4  79.09,95.09 270 top
D5  57.09,41.09 270 top
D6  79.09,41.09 270 top
D7  GREEN  [0805_LED']  96.09,56.09 90 top
D8  48.09,104.09 180 bottom
D9  88.09,104.09 0 bottom
D10  48.09,32.09 0 bottom
D11  88.09,32.09 0 bottom
J1  89.09,57.09 90 top
J3  103.09,64.09 90 top
J4  72.09,60.09 180 top
J5  46.09,58.09 90 top
MP1  43.09,93.09 225 top
MP2  93.09,93.09 135 top
MP3  43.09,43.09 315 top
MP4  93.09,43.09 45 top
NB1  64.09,39.09 0 top
Q1  52.09,95.09 90 top
Q2  84.09,95.09 90 top
Q3  52.09,42.09 90 top
Q4  84.09,42.09 90 top
Q5  67.09,100.09 90 top
R1  62.09,44.09 90 top
R2  83.09,81.09 180 top
R3  83.09,78.09 180 top
R4  44.09,84.09 90 top
R5  92.09,84.09 90 top
R6  49.09,37.09 180 top
R7  87.09,37.09 0 top
R8  72.09,74.09 90 top
R9  76.09,74.09 90 top
R10  62.09,87.09 180 top
R11  60.09,95.09 90 top
R12  101.09,48.09 0 top
R13  73.09,97.09 0 top
R14  66.09,94.09 90 top
S1  105.09,56.09 90 top
SW1  59.09,33.09 270 top
U1  56.09,72.09 0 top
U2  68.09,68.09 0 top
U$1  [LAYER_LABELS]  68.09,136.09 0 top
U$2  [MOTOR_AND_PROP]  8.09,128.09 0 top
U$3  [MOTOR_AND_PROP]  8.09,8.09 0 top
U$4  [MOTOR_AND_PROP]  128.09,8.09 0 top
U$5  [MOTOR_AND_PROP]  128.09,128.09 0 top
U$6  [VALLARTAEXPRESS_LOGO]  52.09,54.09 0 top
U$7  [2-56-MOUNTING-HOLE-NO-METAL]  79.59,88.09 0 top
U$8  [2-56-MOUNTING-HOLE-NO-METAL]  79.59,48.09 0 top
U$9  [2-56-MOUNTING-HOLE-NO-METAL]  56.59,48.09 0 top
U$10  [2-56-MOUNTING-HOLE-NO-METAL]  56.59,88.09 0 top
VR1  70.09,42.09 0 top
Y1  57.09,81.59 180 top

### Tracks (layer width: path | path; a pad name or v marks a point on that pad's centre or on a via)
3V3  (via drill 0.35, 0.51)
  Top 0.254: C11.1 v64.03,76.09 | R8.2 v72.09,76.19 | C9.1 72.09,70.15 v71.66,70.59 | U1.23 55.34,68.59 v57.59,68.59 59.84,68.59 60.09,68.84 U1.34 | 67.34,64.84 C8.1 66.13,64.59 v65.9,64.83 | 69.34,67.34 U2.8 70.11,67.34 v70.33,67.12 | 76.09,75.09 83.09,75.09 83.09,78.84 83.34,79.09 97.84,79.09 103.09,84.34 J3.9 | 76.09,75.09 R9.2 | U1.59 54.87,76.95 54.87,76.02 55.4,75.49 56.79,75.49 57.37,76.07 | U2.12 69.09,69.51 69.09,69.97 v69.15,70.03 | v58.09,78.49 57.63,78.03 57.51,78.03 57.34,77.86 U1.54 57.37,76.95 57.37,76.07 | C12.1 v63.89,73.09 63.14,73.84 U1.44 60.95,73.87 60.1,73.87 59.87,74.09 v59.59,74.09 | 57.37,76.07 57.79,75.64 v57.79,75.49 | R1.2 v62.09,47.79 | v70.79,47.99 70.79,46.13 C15.1 | v69.09,47.99 69.14,47.94 VR1.5 | C14.1 74.09,43.79 76.39,46.09 76.39,47.49 v75.99,47.89 | v67.43,66.36 67.59,66.52 U2.5 | 76.09,75.09 76.09,75.77 v76.35,76.03
  Route15 0.254: v57.79,75.49 59.19,74.09 v59.59,74.09
  Bottom 0.254: 57.67,68.67 v57.59,68.59
  pour Route15: 49.31,67.95 49.24,67.88 49.14,67.84 43.35,67.84 43.35,53.2 49.1,47.45 80.09,47.45 85.74,53.1 85.74,87.09 84.99,87.84 50.2,87.84 47.24,84.88 47.14,84.84 34.35,84.84 34.35,81.35 40.14,81.35 40.24,81.31 42.2,79.35 49.14,79.35 49.24,79.31 49.31,79.24 49.35,79.14 49.35,68.04
BAT_GND  (via drill 0.51)
  Top 0.127: NB1.2 64.79,39.09
  Top 0.762: v53.04,92.74 Q1.S | Q2.S 87.42,94.22 v87.44,94.24 89.75,94.24 MP2.G2 MP2.G1 | v53.04,39.74 Q3.S | C13.2 v66.09,39.76 | C10.2 v75.16,35.09 | S1.A v100.37,53.59 | 47.09,40.39 v47.19,40.29 46.64,40.85 MP3.G2 MP3.G1 | v66.09,39.76 66,39.67 | v66.09,39.76 66.02,39.69 | 64.79,39.09 65.52,39.09 66.09,39.66 v66.09,39.76 | MP4.G1 90.58,41.12 | v47.94,94.84 45.83,94.84 MP1.G1 MP1.G2 | MP4.G1 MP4.G2 | Q4.S 85.42,40.84 v86.14,40.84 MP4.G1 | Q5.S 68.09,99.17 68.09,97.63 v68.36,97.36
  pour Route2: 87.43,46.08 87.34,46.04 46.84,46.04 46.75,46.08 42.99,49.84 39.2,49.84 33.34,43.99 33.34,40.2 44.2,29.34 91.99,29.34 112.84,50.2 112.84,85.99 92.99,105.84 40.2,105.84 34.34,99.99 34.34,87.34 45.99,87.34 48.95,90.3 49.04,90.34 87.14,90.34 87.23,90.3 90.3,87.23 90.34,87.14 90.34,49.04 90.3,48.95
GND  (via drill 0.35, 0.51, 0.76)
  Top 0.254: 51.89,70.82 51.94,70.87 52.09,70.87 52.22,71 52.22,71.19 52.09,71.32 51.94,71.32 51.89,71.37 52.09,71.37 52.27,71.55 52.27,72.63 52.09,72.82 51.23,72.82 U1.7 51.19,72.87 50.3,72.87 48.48,74.69 47.09,74.69 | 51.19,70.82 U1.11 48.84,70.84 48.09,70.09 48.09,67.7 C1.1 | D7.C v96.09,58.92 | C4.2 v49.06,82.89 | SW1.4 v52.77,30.84 | SW1.3 v65.42,30.84 | C6.2 49.31,79.93 v48.96,80.19 | C8.2 v70.42,64.69 | J5.3 v50.72,56.82 | C9.2 v72.09,65.76 | R4.1 v44.09,81.72 | C14.2 v74.09,39.76 | v68.02,73.09 C12.2 | v68.12,76.09 C11.2 | R5.1 v92.09,81.72 | R7.1 v84.35,37.09 | U1.24 55.84,64.67 55.26,64.09 C5.2 | 54.7,64.09 53.71,63.1 52.69,63.1 52.38,63.41 52.38,64.77 52.69,65.08 52.99,65.08 53.84,65.93 U1.20 | 60.95,69.32 61.89,69.32 62.03,69.17 62.03,68.51 61.89,68.37 | U1.35 60.95,69.32 | 60.95,69.32 60.1,69.32 | 61.89,68.37 61,68.37 U1.33 | U2.7 U2.6 | 61.89,68.37 61.09,67.57 v61.09,67.29 | v56.99,78.49 56.84,78.34 U1.55 56.82,76.95 56.82,76.1 56.63,75.91 55.55,75.91 55.37,76.1 55.37,76.95 U1.58 55.34,77.94 v54.99,78.29 | U1.45 61,74.37 61.89,74.37 62.03,74.51 62.03,76.28 v62.17,76.42 | U1.61 53.84,77.94 53.59,78.19 v53.59,78.21 | 47.09,74.69 44.69,74.69 44.09,74.09 C2.2 | 47.09,74.69 B1.5 | VR1.2 70.09,39.49 v70.12,39.47 | D1.C 80.36,70.09 v80.1,69.82 | R14.1 v66.09,91.09 | R6.1 50.77,37.09 v51.12,37.44 | v63.99,81.76 62.16,81.76 C3.2 | v79.47,64.84 79.72,65.09 D2.A | C15.2 74.68,46.09 v74.85,46.27
  other vias: 56.42,64.09 69.99,65.99 69.95,68.87 65.68,68.21
  pour Bottom: 42.3,50.95 42.23,50.88 42.14,50.84 27.93,50.84 27.34,42.08 27.34,42.03 27.34,42.03 27.34,42.03 27.32,41.98 27.3,41.94 27.3,41.94 27.3,41.94 27.26,41.91 -5.69,12.42 8.75,-7.79 40.88,26.23 40.88,26.23 40.91,26.27 40.95,26.3 40.95,26.3 40.95,26.3 40.99,26.32 41.04,26.34 41.04,26.34 41.04,26.34 41.09,26.34 41.14,26.34 41.14,26.34 94.09,26.34 94.13,26.35 94.14,26.34 94.14,26.34 94.18,26.33 94.22,26.31 94.23,26.31 94.23,26.3 94.27,26.27 136.4,-11.84 140.1,8.55 109.91,41.92 109.88,41.95 109.88,41.96 109.87,41.96 109.86,42 109.84,42.04 109.84,42.05 109.84,42.06 109.84,42.1 109.84,93.05 109.84,93.05 109.84,93.1 109.84,93.14 109.84,93.15 109.84,93.15 109.86,93.19 109.88,93.23 109.88,93.24 109.88,93.24 109.92,93.27 109.95,93.3 109.95,93.31 140.72,122.61 134.66,148.85 85.47,109.91 85.45,109.88 85.43,109.88 85.42,109.87 85.39,109.86 85.35,109.84 85.34,109.84 85.32,109.84 85.29,109.84 41.14,109.84 41.13,109.84 41.09,109.84 41.04,109.84 41.04,109.85 41.03,109.85 40.99,109.86 40.95,109.88 40.95,109.89 40.94,109.89 40.91,109.92 40.88,109.95 40.88,109.96 13.15,140.95 -9.69,138.66 27.55,74.34 42.14,74.34 42.23,74.3 42.3,74.23 42.34,74.14 42.34,51.04
  pour Route2: 43.43,78.23 43.45,78.14 43.45,53.24 49.14,47.55 80.04,47.55 85.73,53.24 85.73,86.94 84.94,87.73 50.24,87.73 47.31,84.8 47.23,84.76 47.14,84.73 34.45,84.73 34.45,81.45 40.14,81.45 40.23,81.43 40.31,81.38 43.38,78.31
  pour Top: 42.15,51.06 42.13,51.04 42.11,51.03 28.12,51.03 -2.84,20.07 -2.84,6.12 6.12,-2.84 135.07,-2.84 143.03,5.12 143.03,132.07 136.07,139.03 -17.75,139.03 27.15,94.13 27.16,94.11 27.16,74.16 42.11,74.16 42.13,74.15 42.15,74.13 42.16,74.11 42.16,51.08
LED_LB  (via drill 0.35)
  Top 0.152: Q5.G 66.09,99.17 R14.2 63.67,92.63 v63.67,91.09 | v54.09,69.09 53.34,68.34 U1.16
  Route2 0.152: v63.67,91.09 63.09,90.51 63.09,78.45 58.98,74.35 58.98,73.98 v54.09,69.09
MISO
  Top 0.127: U1.39 61.87,71.34 62.22,71.7 72.74,71.7 77.29,67.14 77.29,65.19 78.79,63.69 89.19,63.69 92.39,60.49 92.39,56.58 J1.1
MOSI  (via drill 0.2, 0.51)
  Top 0.127: U1.38 61.84,70.84 63.09,69.59 v63.6,69.59 | J1.4 v75.89,57.09
  Bottom 0.127: v75.89,57.09 74.03,57.09 73.82,56.88 72.21,56.88 70.88,58.21 70.88,60.48 70.06,61.31 68.69,61.31 62.59,67.4 62.59,68.99 63.19,69.59 v63.6,69.59
N$1
  Top 0.127: C1.2 B1.2
N$4
  Top 0.127: 45.89,71.2 45.98,71.29 B1.1
  Top 1.27: 45.89,71.2 C2.1 43.99,71.09 A1.FEED
N$6
  Top 0.762: Q1.D 54.42,96.24 D3.2 51.7,89.18 46.19,89.18 44.76,90.61 MP1.2
N$8  (via drill 0.2)
  Top 0.127: v83.09,72.34 83.09,70.09 D1.A | v83.84,79.84 83.84,81.09 R2.1
  Bottom 0.127: v83.84,79.84 83.84,74.72 84,74.57 84,73.25 v83.09,72.34
N$9
  Top 0.127: C3.1 61.89,83.39 61.24,82.74 Y1.1 58.94,82.34 56.34,79.74 U1.56
N$10
  Top 0.127: C4.1 52.09,82.5 54.14,80.44 Y1.3 55.22,80.09 55.84,79.47 U1.57
N$11
  Top 0.127: 54.59,66.09 54.84,66.34 U1.22 | U1.21 54.34,66.09 54.59,66.09 | C5.1 53.34,64.24 53.34,64.84 54.59,66.09
N$12
  Top 0.127: C6.1 52.72,80.09 54.34,78.47 U1.60
N$13
  Top 0.762: MP2.2 81.19,91.47 D4.2 81.77,96.24 Q2.D
N$14
  Top 0.762: MP3.2 50.62,44.71 Q3.D 53.42,43.24 D5.2
N$15
  Top 0.762: D6.2 79.49,39.57 83.22,43.3 84.03,43.3 Q4.D 91.03,43.24 91.97,44.19 91.97,45.03 91.47,45.53 MP4.2
N$16
  Top 0.152: C7.1 45.2,51.79 44.24,52.74 J5.4
N$17  (via drill 0.2)
  Top 0.127: R3.1 84.09,78.09 84.09,74.92 v83.55,74.38 | D2.C 82.68,65.81 v82.68,67.84
  Bottom 0.127: v82.68,67.84 82.65,67.87 82.65,73.48 v83.55,74.38
N$20
  Top 0.127: D7.A 96.09,53.84 101.84,48.09 R12.2
N$21  (via drill 0.51)
  Top 0.254: R13.1 72.19,97.04 72.19,95.93 v72.61,95.51
  Route15 0.254: v89.09,34.49 88.99,34.59 88.99,80.75 80.2,89.55 78.21,89.55 72.43,95.33 | v72.61,95.51 72.43,95.33 | v89.09,101.59 82.83,95.33 72.43,95.33
  Bottom 0.254: v89.09,34.49 89.08,34.48 D11.A 85.88,28.89 52.28,28.89 D10.A | v89.09,101.59 89.09,104.08 | 89.09,104.08 D9.A | D8.A 49.31,106.29 87.29,106.29 89.09,104.49 89.09,104.08
N$22  (via drill 0.51)
  Top 0.254: Q5.D 63.24,101.24 v63.09,101.09
  Route15 0.254: 74.59,44.09 73.5,44.09 66.29,44.09 65.89,44.49 58.84,44.49 58.14,45.19 55.69,45.19 46.59,36.09 v46.59,34.79 | 74.59,44.09 77.73,44.09 86.78,53.14 86.78,80.4 80.55,86.64 78.99,86.64 78.14,87.49 78.14,89.05 66.09,101.09 v63.09,101.09 | v63.09,101.09 60.79,103.39 v52.59,103.39 | v63.09,101.09 66.09,104.09 v83.99,104.09 | v85.09,34.29 84.39,34.29 74.59,44.09
  Bottom 0.254: D10.C 46.58,34.78 v46.59,34.79 | D11.C 85.09,33.58 v85.09,34.29 | D9.C v83.99,104.09 | D8.C 51.89,104.09 v52.59,103.39
PG0  (via drill 0.2)
  Top 0.127: v66.59,78.34 79.34,78.34 82.09,81.09 R2.2 | v59.59,71.34 59.09,71.84 54.59,71.84 52.09,69.34 U1.14
  Bottom 0.127: v59.59,71.34 60.02,71.34 66.59,77.92 v66.59,78.34
PG1  (via drill 0.2)
  Top 0.127: U1.15 52.09,68.84 53.09,69.84 57.34,69.84 58.28,70.78 v58.28,71.14 | R3.2 82.09,78.09 81.09,77.09 69.85,77.09 67.4,74.64 v62.54,74.64
  Bottom 0.127: v58.28,71.14 59.13,71.99 59.94,71.99 60.44,72.49 60.44,72.72 62.36,74.64 v62.54,74.64
PWM1  (via drill 0.51)
  Top 0.127: R4.2 v44.09,86.84 | 50.59,94.09 51.09,94.09 Q1.G | v52.94,75.34 55.94,72.34 U1.41 64.54,72.34 64.71,72.17 76.67,72.17 77.34,72.84 99.34,72.84 103.09,76.59 J3.6
  Top 0.762: v49.34,92.84 50.59,94.09
  Bottom 0.127: v49.34,92.84 49.34,92.09 v44.09,86.84 44.09,84.19 v52.94,75.34
PWM2  (via drill 0.51)
  Top 0.127: U1.49 62.67,79.8 64.33,79.8 69.59,85.05 R5.2
  Top 0.762: v90.99,86.19 92.09,85.09 R5.2 | Q2.G 83.14,92.64 v83.09,92.59
  Bottom 0.127: J3.5 103.59,73.75 103.59,72.94 90.99,85.54 v90.99,86.19 89.49,86.19 v83.09,92.59
PWM3  (via drill 0.35, 0.51)
  Top 0.127: R6.2 48.34,37.09 50.84,39.59 50.84,41.09 51.09,41.09 Q3.G 51.09,41.34 | v59.83,78.43 59.34,77.95 U1.50
  Top 0.762: 51.09,41.34 50.75,41.68 50.42,41.68 49.41,42.69 v49.34,42.69
  Route2 0.127: J3.4 103.09,71.84 97.84,71.84 80.09,89.59 65.91,89.59 63.89,91.61 62.88,91.61 62.57,91.31 62.57,81.86 59.83,79.11 v59.83,78.43
  Bottom 0.127: v49.34,42.69 49.34,67.95 v59.83,78.43
PWM4  (via drill 0.51)
  Top 0.127: 87.89,37.09 R7.2 | U1.51 58.84,78.54 60.38,80.08 64.22,80.08 69.94,85.8 v86.14,85.8
  Top 0.762: 86.54,38.44 84.99,38.34 83.14,40.19 Q4.G | 86.54,38.44 86.67,38.32 86.68,38.32 87.13,37.87 87.13,37.85 87.89,37.09 | v87.2,39.2 87.2,39.1 86.54,38.44
  Bottom 0.127: v86.14,85.8 102.59,69.34 103.09,69.34 J3.3 103.09,68.84 101.59,67.34 101.59,53.44 87.35,39.2 v87.2,39.2
PWM5  (via drill 0.2)
  Top 0.127: R11.1 v59.89,92.99 | v59.59,73.04 59.79,72.84 U1.42 | v59.89,86.99 R10.2
  Bottom 0.127: v59.89,92.99 v59.89,86.99 59.89,79.61 60.63,78.88 60.63,78.38 59,76.75 59,73.85 59.59,73.25 v59.59,73.04
PWR_LED
  Top 0.127: VR1.3 72.34,42.09 75.84,42.09 81.84,48.09 R12.1 100.34,48.09 101.59,46.84 104.09,46.84 104.09,54.34 S1.C
RESET
  Top 0.127: 62.09,35.34 R1.1 59.5,43.14 57.67,44.97 | SW1.1 62.09,35.34 | 62.09,35.34 SW1.2 | 43.59,49.29 43.59,52.83 42.98,53.44 42.98,62.98 | J1.5 91.63,59.63 92.09,60.09 92.09,60.19 91.19,61.09 84.92,61.09 82.3,58.48 74.81,58.48 73.22,56.88 71.63,56.88 69.36,54.61 64.88,54.61 61.5,51.23 61.5,46.75 59.72,44.97 57.67,44.97 | 53.34,46.84 55.79,46.84 57.67,44.97
  Top 0.152: 53.34,46.84 49.24,46.84 48.04,48.04 | 48.04,48.04 C7.2 | 43.59,49.29 43.59,49.27 44.82,48.04 48.04,48.04 | U1.12 51.14,70.27 50.32,70.27 49.09,69.04 49.09,65.09 48.09,64.09 44.09,64.09 42.98,62.98
RF_N
  Top 0.127: B1.3 47.74,71.7 47.99,71.95 50.07,71.95 50.18,71.84 U1.9
RF_P
  Top 0.127: B1.4 47.74,72.48 47.99,72.23 50.07,72.23 50.18,72.34 U1.8
SCK  (via drill 0.2, 0.51)
  Top 0.127: U1.37 61.84,70.34 63.34,68.84 v63.6,68.84 | J1.3 89.21,55.94 87.34,55.94 87.29,55.99 85.19,55.99 v84.85,56.34
  Bottom 0.127: v63.6,68.84 71.14,61.31 72.6,61.31 75.56,58.34 82.21,58.34 84.21,56.34 v84.85,56.34
SCL  (via drill 0.2)
  Top 0.127: 72.34,70.84 73.34,69.84 73.34,63.34 69.59,63.34 | 69.59,63.34 59.34,63.34 56.34,66.34 U1.25 | J3.7 103.09,79.09 97.34,73.34 76.09,73.34 R9.1 74.55,73.14 v74.43,73.25 | U2.13 68.09,69.93 69.27,71.1 71.87,71.1 72.13,70.84 72.34,70.84 | J4.2 69.55,63.3 69.59,63.34 | 72.34,70.84 72.44,70.94 v72.44,71.25 v72.43,71.25
  Bottom 0.127: v72.43,71.25 v74.43,73.25
SDA  (via drill 0.2)
  Top 0.127: U2.14 67.59,69.59 66.84,69.59 | 61.54,66.54 60.84,65.84 57.34,65.84 56.84,66.34 U1.26 | v70.34,73.09 72.09,73.09 | 66.84,69.59 v68.09,70.84 | 72.09,73.09 73.09,73.09 73.94,73.94 95.19,73.94 103.09,81.84 J3.8 | 72.09,73.09 R8.1 | J4.1 v72.09,61.9 | 61.54,66.54 62.19,65.89 v62.19,65.79 | 61.54,66.54 63.4,68.4 63.78,68.4 64.98,69.59 66.84,69.59
  Route2 0.127: v62.19,65.79 66.08,61.9 v72.09,61.9
  Bottom 0.127: v70.34,73.09 v68.09,70.84
SRX  (via drill 0.2)
  Top 0.127: v56.09,72.84 56.12,72.87 56.8,72.87 58.77,74.84 U1.46
  Top 0.152: J5.2 44.85,59.36 45.73,58.49 48.99,58.49 v50.34,59.84
  Bottom 0.127: v56.09,72.84 50.34,67.09 v50.34,59.84
STX  (via drill 0.2)
  Top 0.127: v49.84,62.09 49.65,61.9 J5.1 | U1.47 58.79,75.34 57.04,73.59 v56.09,73.59
  Bottom 0.127: v56.09,73.59 49.84,67.34 v49.84,62.09
VBAT  (via drill 0.51, 0.76)
  Top 0.762: D4.1 v79.09,97.96 | D6.1 v79.09,43.86 | C10.1 v81.02,35.09 | S1.B v100.37,58.59 | v90.29,89.39 MP2.1 | v46.79,90.39 46.69,90.39 MP1.1 | v45.79,46.69 MP3.1 | R11.2 v59.89,97.09 | R13.2 v75.09,97.09 | v89.65,45.79 89.65,45.63 MP4.1 | VR1.1 v67.79,40.79 67.79,42.69 67.5,42.99 C13.1
  Top 1.27: D3.1 v56.59,98.36 | v57.09,44.34 D5.1
  pour Route15: 87.43,45.96 87.34,45.93 46.85,45.93 46.75,45.96 46.67,46 42.94,49.73 39.24,49.73 33.45,43.94 33.45,40.24 44.24,29.45 91.94,29.45 112.73,50.24 112.73,85.94 92.94,105.73 40.24,105.73 34.45,99.94 34.45,87.45 45.94,87.45 49.07,90.58 49.15,90.63 49.25,90.65 86.94,90.65 87.03,90.63 87.11,90.58 90.38,87.31 90.43,87.23 90.45,87.14 90.45,49.05 90.43,48.95 90.38,48.87 87.51,46
(copper drawn outside any net)
  shapes: Route15 area x1, Route2 area x1

### Text on the board
tPlace: VBAT | 3V3 | SDA | SCL | PWM1 | PWM2 | PWM3 | PWM4 | BAT_GND | GND | Christopher Vu / Darryl Tayag